# EAGLE board Wio LTE Cat NB1 v1.02 (EAGLE 6.4), part 1 of 2
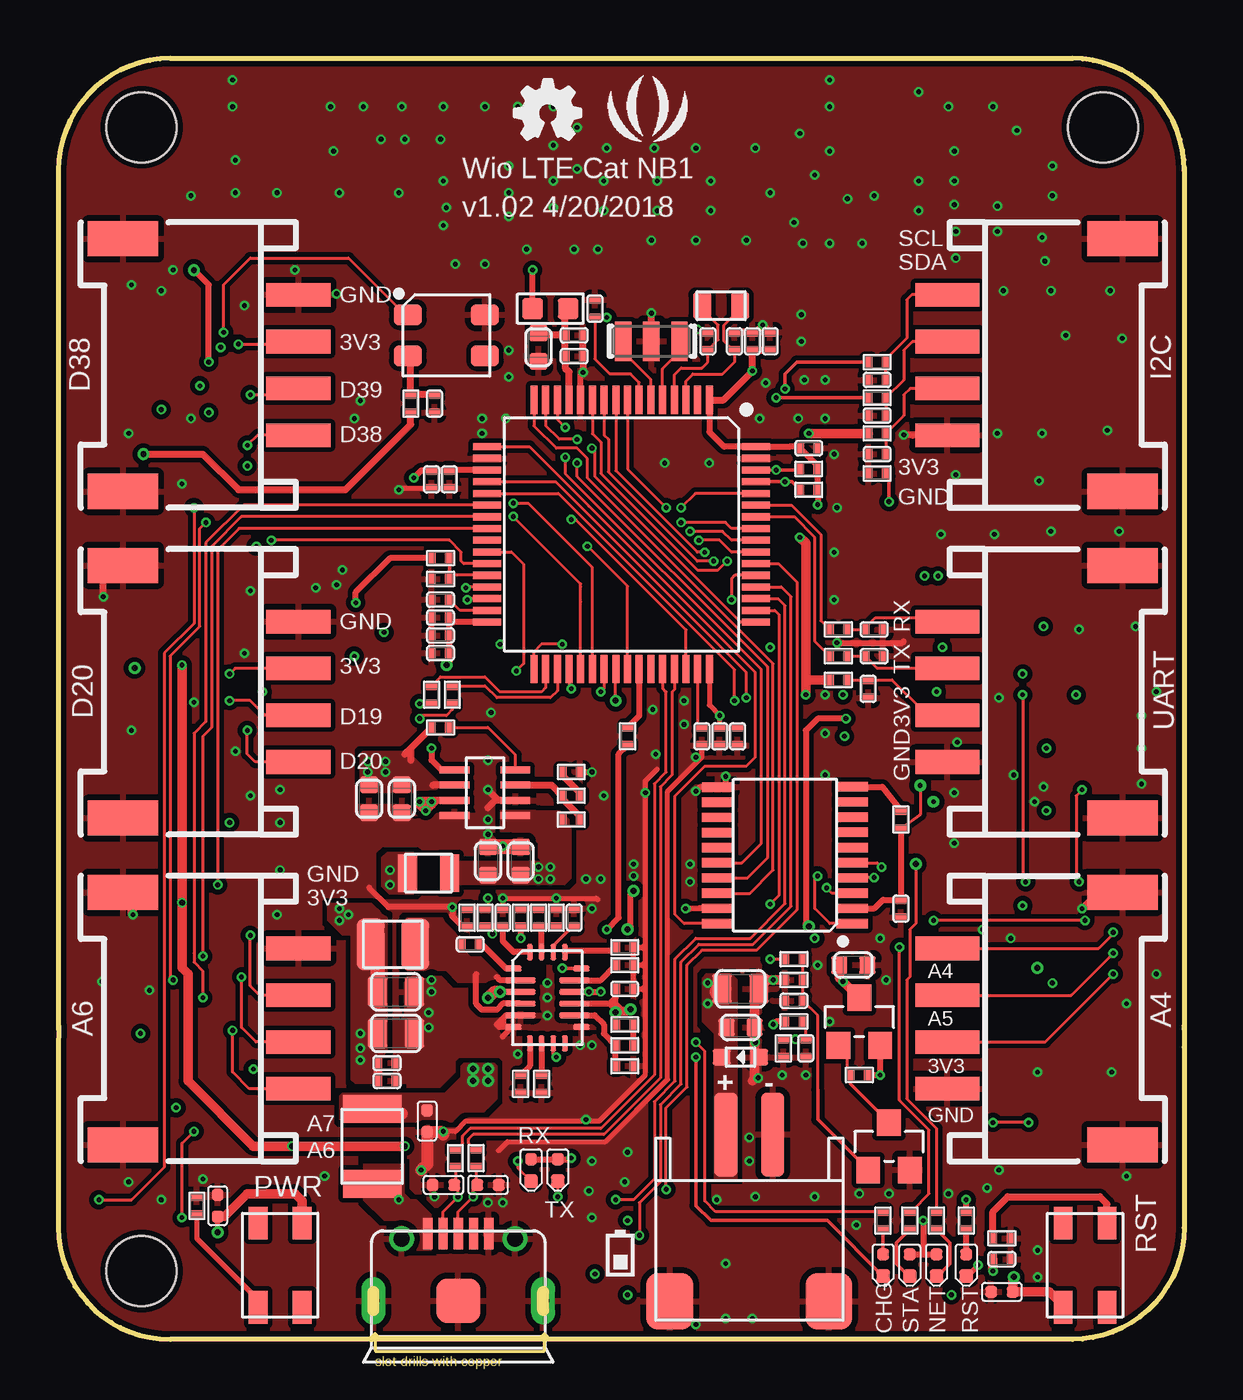
[diagram p7: board, top side]
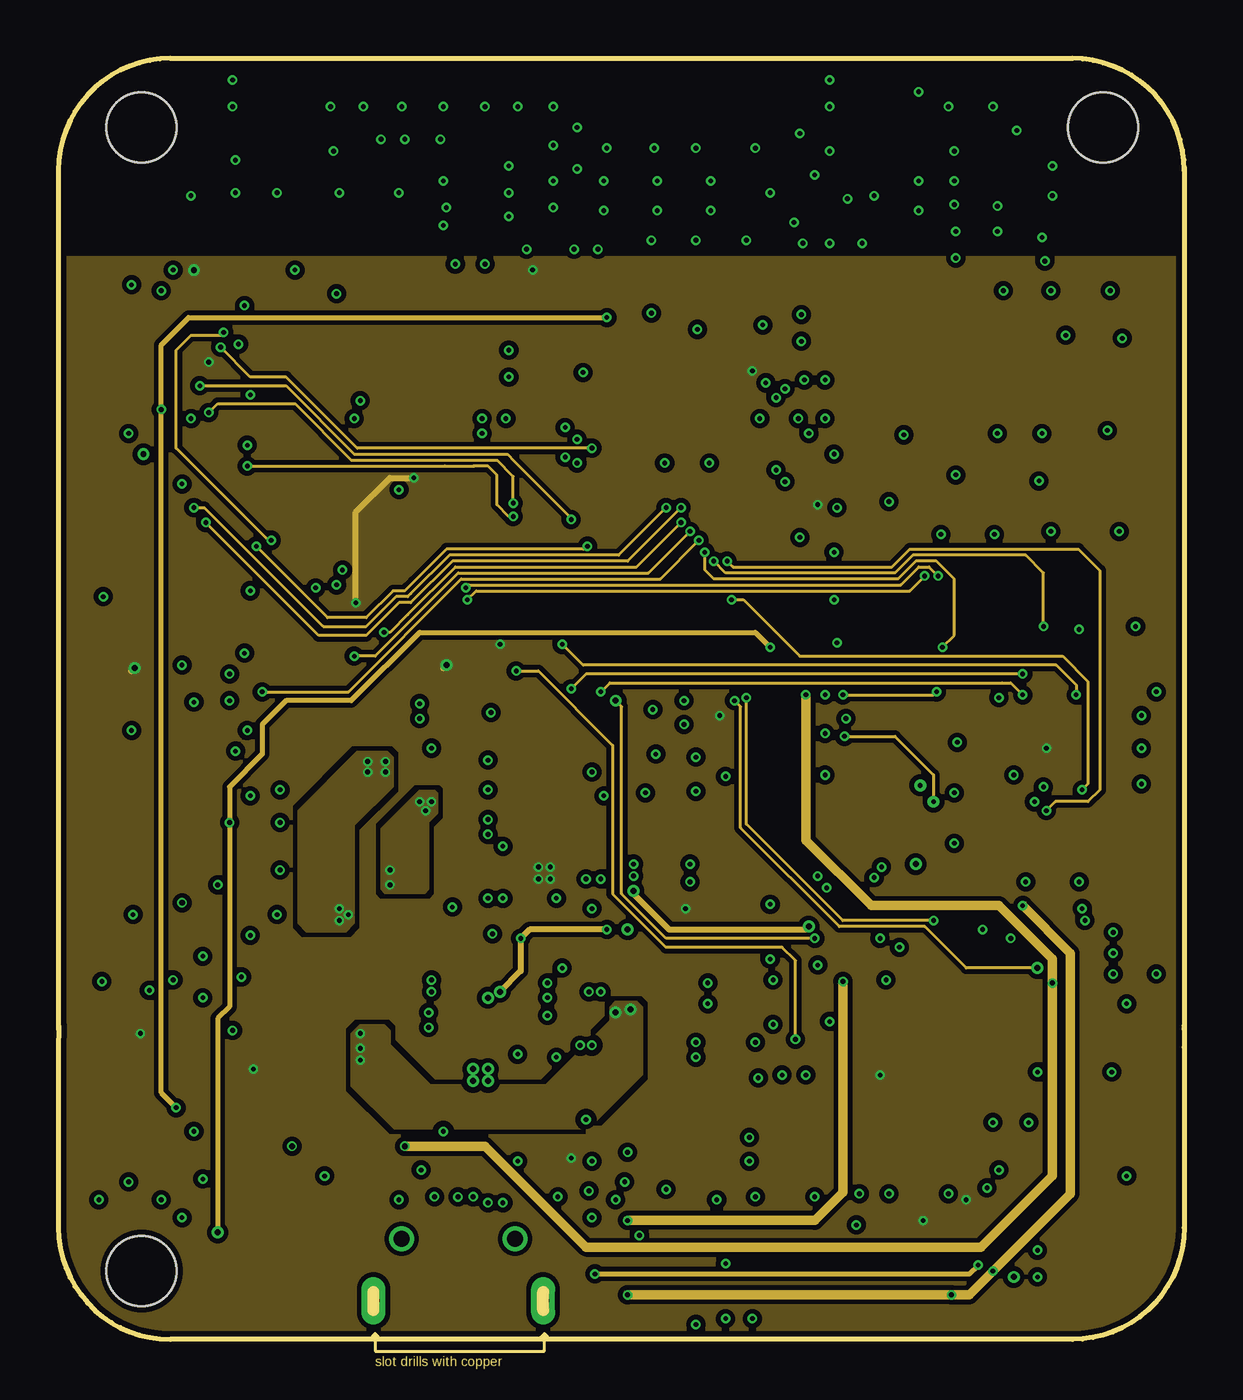
[diagram p8: board, inner layer VDD_3V3]
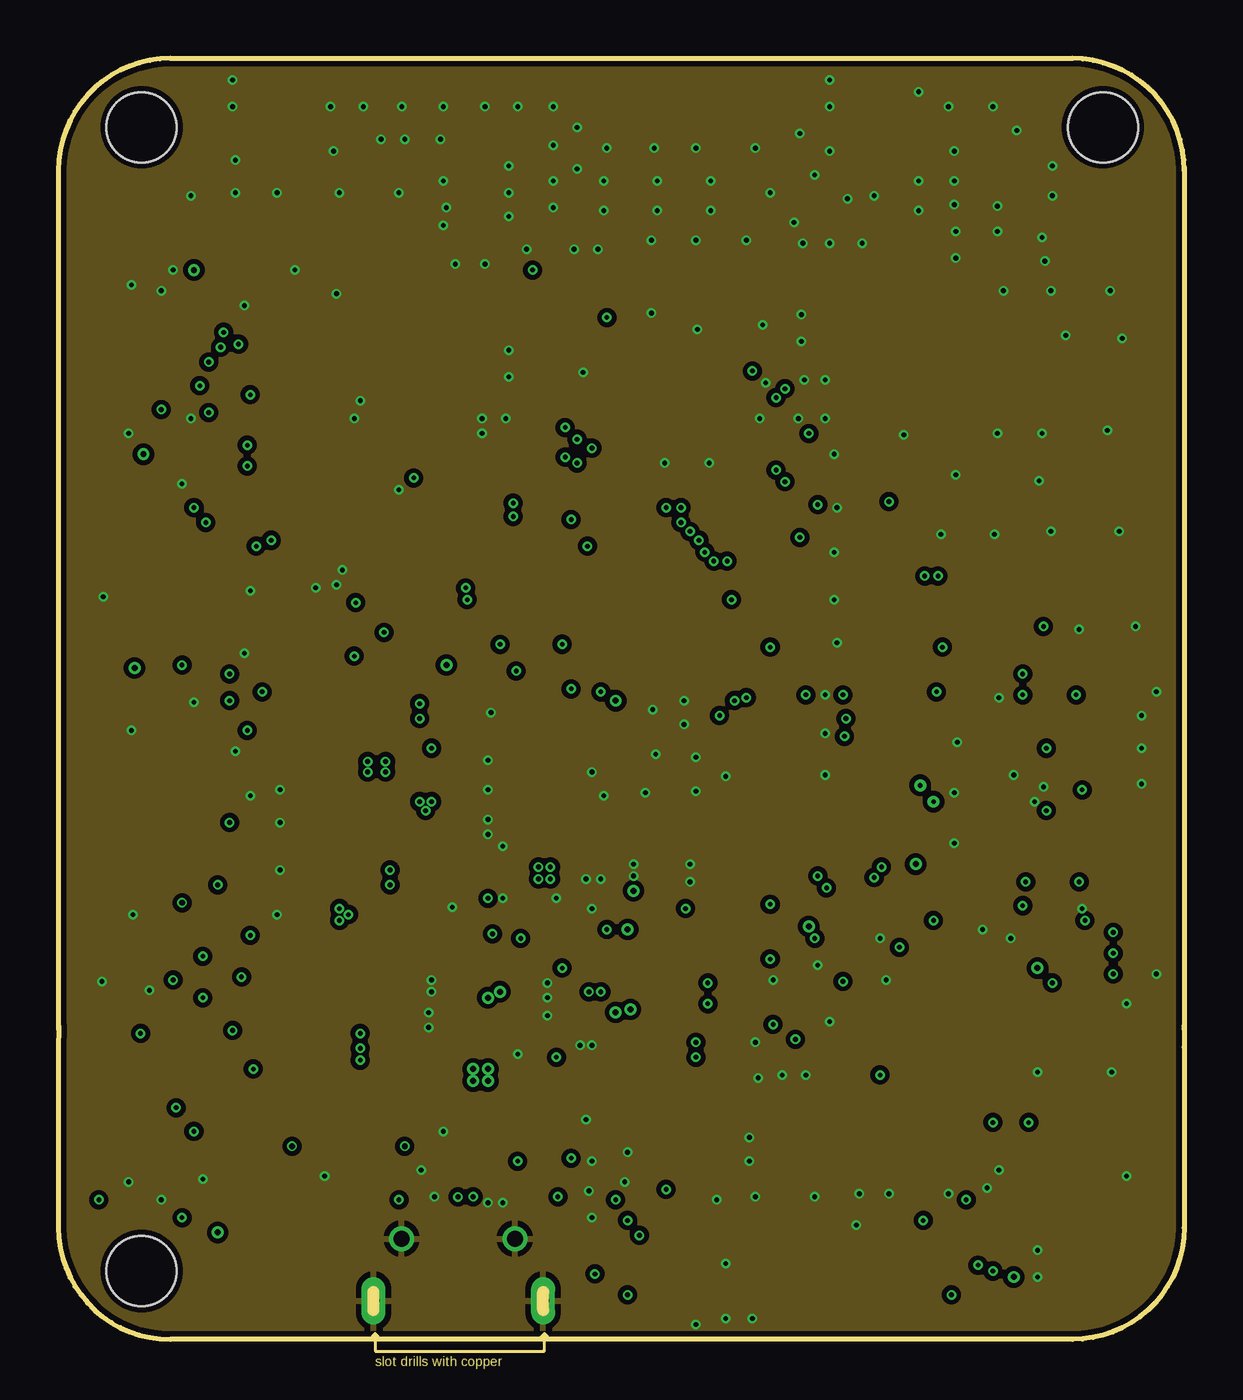
[diagram p9: board, inner layer GND]
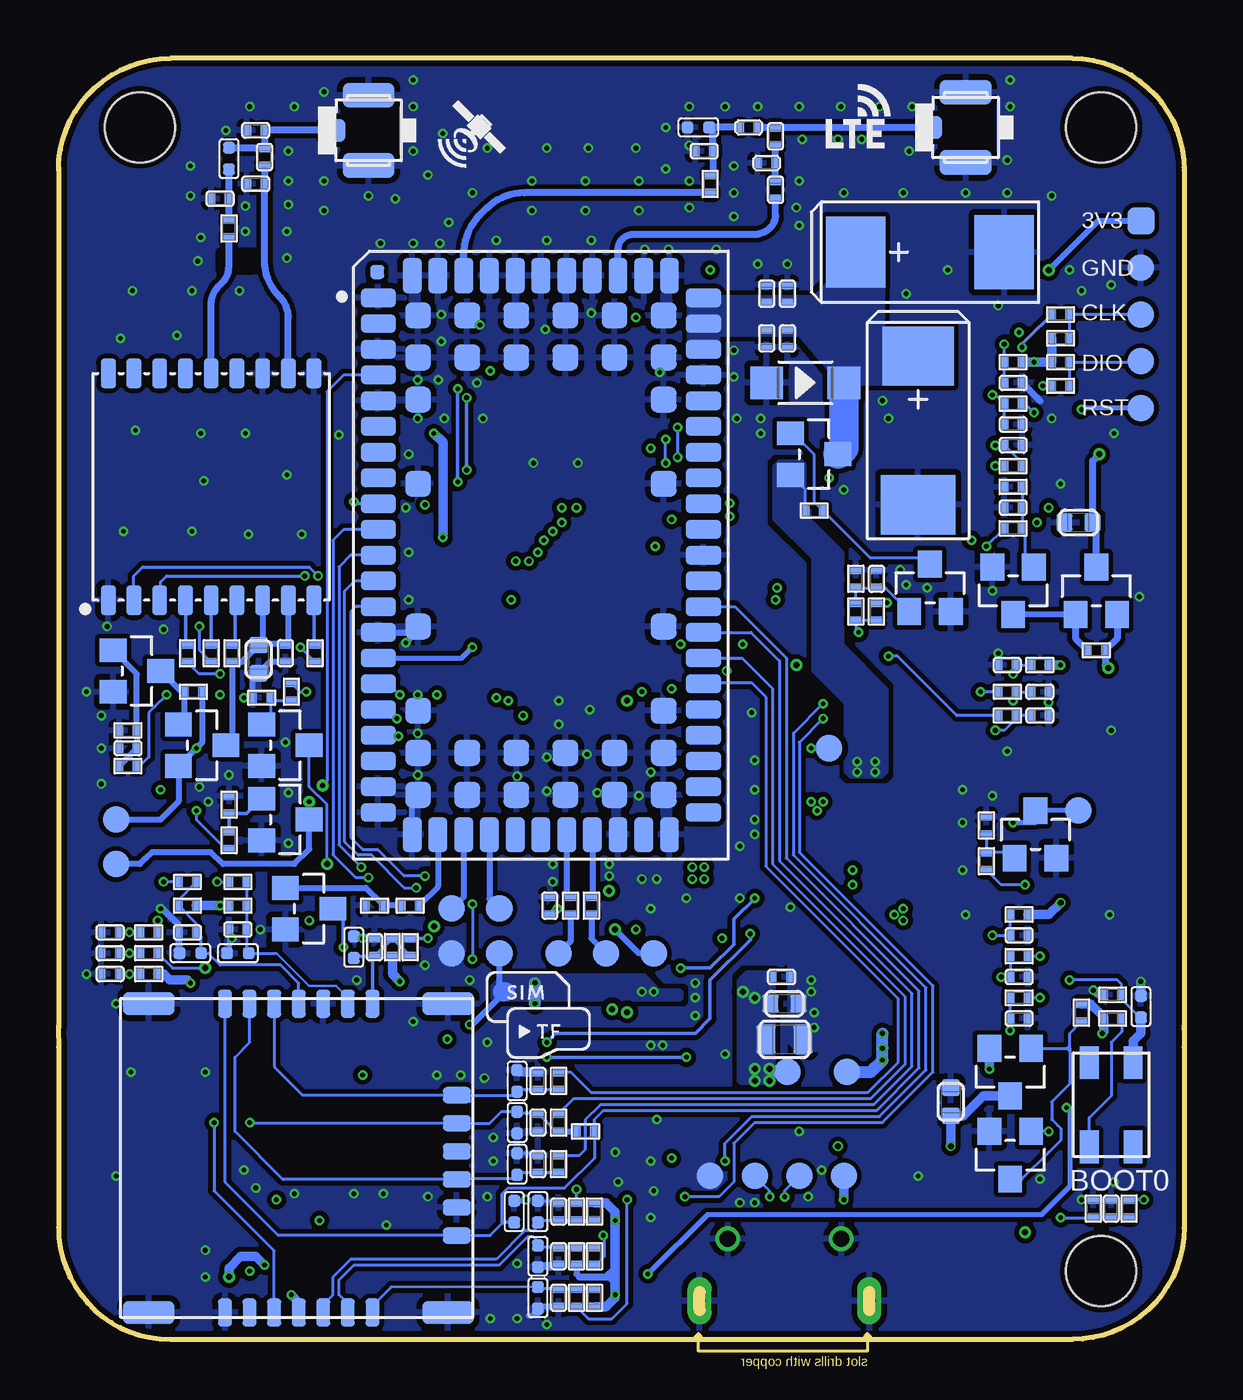
[diagram p10: board, bottom side, seen from below]

Size 48.13 x 54.76 mm. Coordinates in mm from the lower left corner, seen from the top.
Outline: 48.13,49.98 arc90 43.35,54.76 4.78,54.76 arc90 0,49.98
Outline: 0,50.11 0,13.31
Outline: 0,13.42 0,13.27 0,12.49 0,4.78 arc90 4.78,0 43.35,0 arc90 48.13,4.78 48.13,12.49 48.13,13.27 48.13,13.42
Outline: 48.13,50.11 48.13,13.31
Copper layers (1*2*15*16): Top 0.035mm / dielectric 0.2mm / VDD_3V3 0.0175mm / dielectric 0.3mm / GND 0.0175mm / dielectric 0.2mm / Bottom 0.035mm
Design rules "SeeedStudio_4layer_DRU_no_angle_20140221 *": minimum track width 1mil, minimum drill 8mil, track to track 4mil, track to pad 4mil, pad to pad 4mil, via to via 4mil, smd to smd 0mil, copper to edge 10mil, drill to drill 8mil, minimum pad ring 3mil, minimum via ring 3mil, stop-mask expansion 4mil, vias tented up to drill 25mil, thermal gap 10mil
Holes 3 mm at 3.55,2.92 44.65,51.82 3.55,51.82
tRestrict: area 31.1,31.4 to 31.8,32.8; area 19.1,15.4 to 20.7,16.1; area 15.6,19.2 to 16.1,20.7
bRestrict: area 39.8,45.7 to 41.2,46.5; area 23.7,16.5 to 24,16.9

## Footprints (pad centres in the part's own frame; a part is rotated, then mirrored left to right if it is on the bottom)
U-FL3P-SMD-2.6X2.6X1.0MM = smd 1.05 x 1: D -1.524,0 | smd 2.2 x 1.05: GND1 0,1.5; GND2 0,-1.5
C0402 = smd 0.508 x 0.385: 1 0,0.383; 2 0,-0.383
C0603 = smd 0.762 x 0.696: 1 0,0.602; 2 0,-0.602
C0805 = smd 0.819 x 1.27: 1 -0.79,0; 2 0.79,0
AVX-D = smd 2.54 x 3.048: + 3.175,0 | smd 2.54 x 3.175: - -3.175,0
SOD-123 = smd 1.397 x 1.397: + 1.651,0; - -1.651,0
LED-0402 = smd 0.5 x 0.5: + 0.463,0 | smd 0.58 x 0.58: - -0.468,0
ESD-0402 = smd 0.5 x 0.5: 1 -0.463,0; 2 0.463,0
SOD-523 = smd 0.762 x 0.7: + 0.8,0; - -0.8,0
F1210 = smd 1.2 x 2.5: 1 -1.6,0; 2 1.6,0
HW4-SMD-2.0-90D = smd 1.01 x 2.74: 1 -3,-0.1; 2 -1,-0.1; 3 1,-0.1; 4 3,-0.1 | smd 1.5 x 3: SS1 -5.4,7.4; SS2 5.4,7.4
SIM+TF-24P-SMD-1.2-15.05X13.66X2.5MM = smd 1.2 x 0.6: P1 0,3.26; P2 0,4.31; P3 0,5.36; P5 13.2,3.26; P6 13.2,4.31; P7 13.2,5.36; T1 13.2,9.56; T2 13.2,8.51; T3 13.2,7.46; T4 13.2,6.41; T5 0,6.41; T6 0,7.46; T7 0,8.51; T8 0,9.56 | smd 0.7 x 1.2: P1B 9.91,13.17; P2B 7.51,13.17; P3B 3.91,13.17; P5B 8.71,13.17; P6B 6.31,13.17; P7B 5.11,13.17 | smd 1 x 2.2: PAD 0,0; PAD1 0,12.8; PAD2 13.2,0; PAD3 13.2,12.8
H5-SMD-2.0-TEST = smd 1.143 x 1.143: 1 0,4; 2 0,2; 3 0,0; 4 0,-2; 5 0,-4
MICRO-USB5+5P-SMD-0.65-7.2X5.06MM = smd 0.4 x 1.35: 1 -1.3,2.875; 2 -0.65,2.875; 3 0,2.875; 4 0.65,2.875; 5 1.3,2.875 | smd 1.9 x 1.9: P1 0,0 | drill 0.508 pad 1.016 long: P3 -3.625,0; P4 3.625,0 | drill 0.7: P5 -2.425,2.65; P6 2.425,2.65
HW2-SMD-2.0-90D = smd 2 x 2.4: 3 3.4,-2.181; 4 -3.4,-2.181 | smd 1 x 3.6: + -1,4.953; - 1,4.953
SW4P-SMD-4.5X3.2X2.5MM = smd 1.4 x 0.8: 1 -1.8,-0.94; 2 1.8,-0.94; 3 1.8,0.94; 4 -1.8,0.94
L0402 = smd 0.5 x 0.5: 1 -0.463,0; 2 0.463,0
L0402' = smd 0.508 x 0.385: 1 0,0.383; 2 0,-0.383
L0603 = smd 0.889 x 0.889: 1 -0.762,0; 2 0.762,0
L201610 = smd 0.8 x 1.6: 1 -0.9,0; 2 0.9,0
L2520 = smd 2.2 x 1.2: 1 0,0.95; 2 0,-0.95
LED4-1.75-3.7X3.5X0.95MM = smd 1.2 x 0.9: 1 -1.65,0.875; 2 -1.65,-0.875; 3 1.65,-0.875; 4 1.65,0.875
SOT-23 = smd 1.143 x 1.016: 1 1.016,-0.889; 2 1.016,0.889; 3 -1.016,0
R0402 = smd 0.508 x 0.385: 1 0,0.383; 2 0,-0.383
TP-D45MIL = smd 1.143 x 1.143: T 0,0
LGA18-1.1-9.7X10.1X2.5MM = smd 1.27 x 0.635: 1 4.85,-4.4; 2 4.85,-3.3; 3 4.85,-2.2; 4 4.85,-1.1; 5 4.85,0; 6 4.85,1.1; 7 4.85,2.2; 8 4.85,3.3; 9 4.85,4.4; 10 -4.85,4.4; 11 -4.85,3.3; 12 -4.85,2.2; 13 -4.85,1.1; 14 -4.85,0; 15 -4.85,-1.1; 16 -4.85,-2.2; 17 -4.85,-3.3; 18 -4.85,-4.4
LQFP64 = smd 0.3 x 1.2: 1 -3.75,-5.75; 2 -3.25,-5.75; 3 -2.75,-5.75; 4 -2.25,-5.75; 5 -1.75,-5.75; 6 -1.25,-5.75; 7 -0.75,-5.75; 8 -0.25,-5.75; 9 0.25,-5.75; 10 0.75,-5.75; 11 1.25,-5.75; 12 1.75,-5.75; 13 2.25,-5.75; 14 2.75,-5.75; 15 3.25,-5.75; 16 3.75,-5.75; 33 3.75,5.75; 34 3.25,5.75; 35 2.75,5.75; 36 2.25,5.75; 37 1.75,5.75; 38 1.25,5.75; 39 0.75,5.75; 40 0.25,5.75; 41 -0.25,5.75; 42 -0.75,5.75; 43 -1.25,5.75; 44 -1.75,5.75; 45 -2.25,5.75; 46 -2.75,5.75; 47 -3.25,5.75; 48 -3.75,5.75 | smd 1.2 x 0.3: 17 5.75,-3.75; 18 5.75,-3.25; 19 5.75,-2.75; 20 5.75,-2.25; 21 5.75,-1.75; 22 5.75,-1.25; 23 5.75,-0.75; 24 5.75,-0.25; 25 5.75,0.25; 26 5.75,0.75; 27 5.75,1.25; 28 5.75,1.75; 29 5.75,2.25; 30 5.75,2.75; 31 5.75,3.25; 32 5.75,3.75; 49 -5.75,3.75; 50 -5.75,3.25; 51 -5.75,2.75; 52 -5.75,2.25; 53 -5.75,1.75; 54 -5.75,1.25; 55 -5.75,0.75; 56 -5.75,0.25; 57 -5.75,-0.25; 58 -5.75,-0.75; 59 -5.75,-1.25; 60 -5.75,-1.75; 61 -5.75,-2.25; 62 -5.75,-2.75; 63 -5.75,-3.25; 64 -5.75,-3.75
MOUDLE96P-SMD-1.1-26X16X2.53MM = smd 1.5 x 0.8: 1 -6.95,11; 2 -6.95,9.9; 3 -6.95,8.8; 4 -6.95,7.7; 5 -6.95,6.6; 6 -6.95,5.5; 7 -6.95,4.4; 8 -6.95,3.3; 9 -6.95,2.2; 10 -6.95,1.1; 11 -6.95,0; 12 -6.95,-1.1; 13 -6.95,-2.2; 14 -6.95,-3.3; 15 -6.95,-4.4; 16 -6.95,-5.5; 17 -6.95,-6.6; 18 -6.95,-7.7; 19 -6.95,-8.8; 20 -6.95,-9.9; 21 -6.95,-11; 33 6.95,-11; 34 6.95,-9.9; 35 6.95,-8.8; 36 6.95,-7.7; 37 6.95,-6.6; 38 6.95,-5.5; 39 6.95,-4.4; 40 6.95,-3.3; 41 6.95,-2.2; 42 6.95,-1.1; 43 6.95,0; 44 6.95,1.1; 45 6.95,2.2; 46 6.95,3.3; 47 6.95,4.4; 48 6.95,5.5; 49 6.95,6.6; 50 6.95,7.7; 51 6.95,8.8; 52 6.95,9.9; 53 6.95,11 | smd 0.8 x 1.5: 22 -5.5,-11.95; 23 -4.4,-11.95; 24 -3.3,-11.95; 25 -2.2,-11.95; 26 -1.1,-11.95; 27 0,-11.95; 28 1.1,-11.95; 29 2.2,-11.95; 30 3.3,-11.95; 31 4.4,-11.95; 32 5.5,-11.95; 54 5.5,11.95; 55 4.4,11.95; 56 3.3,11.95; 57 2.2,11.95; 58 1.1,11.95; 59 0,11.95; 60 -1.1,11.95; 61 -2.2,11.95; 62 -3.3,11.95; 63 -4.4,11.95; 64 -5.5,11.95 | smd 1.1 x 1.1: 65 -5.25,10.25; 66 -3.15,10.25; 67 -1.05,10.25; 68 1.05,10.25; 69 3.15,10.25; 70 5.25,10.25; 71 -5.25,8.45; 72 -3.15,8.45; 73 -1.05,8.45; 74 1.05,8.45; 75 3.15,8.45; 76 5.25,8.45; 77 -5.25,6.65; 78 5.25,6.65; 79 -5.25,3.05; 80 5.25,3.05; 81 -5.25,-3.05; 82 5.25,-3.05; 83 -5.25,-6.65; 84 5.25,-6.65; 85 -5.25,-8.45; 86 -3.15,-8.45; 87 -1.05,-8.45; 88 1.05,-8.45; 89 3.15,-8.45; 90 5.25,-8.45; 91 -5.25,-10.25; 92 -3.15,-10.25; 93 -1.05,-10.25; 94 1.05,-10.25; 95 3.15,-10.25; 96 5.25,-10.25 | smd 0.6 x 0.6: P$1 -7,12.1
TSOT23-8 = smd 0.3 x 1.27: 1 -0.975,-1.3; 2 -0.325,-1.3; 3 0.325,-1.3; 4 0.975,-1.3; 5 0.975,1.3; 6 0.325,1.3; 7 -0.325,1.3; 8 -0.975,1.3
QFN20-0.5-3X4X1MM = smd 0.7 x 0.25: 1 -1.45,1.25; 6 -1.45,-1.25; 11 1.45,-1.25; 16 1.45,1.25 | smd 1.3 x 0.25: 2 -1.15,0.75; 3 -1.15,0.25; 4 -1.15,-0.25; 5 -1.15,-0.75; 12 1.15,-0.75; 13 1.15,-0.25; 14 1.15,0.25; 15 1.15,0.75 | smd 0.25 x 0.7: 7 -0.75,-1.95; 8 -0.25,-1.95; 9 0.25,-1.95; 10 0.75,-1.95; 17 0.75,1.95; 18 0.25,1.95; 19 -0.25,1.95; 20 -0.75,1.95
TSSOP20-0.65-6.5X4.4MM = smd 0.4 x 1.35: 1 -2.925,-2.875; 2 -2.275,-2.875; 3 -1.625,-2.875; 4 -0.975,-2.875; 5 -0.325,-2.875; 6 0.325,-2.875; 7 0.975,-2.875; 8 1.625,-2.875; 9 2.275,-2.875; 10 2.925,-2.875; 11 2.91,2.875; 12 2.26,2.875; 13 1.61,2.875; 14 0.96,2.875; 15 0.325,2.875; 16 -0.325,2.875; 17 -0.975,2.875; 18 -1.625,2.875; 19 -2.275,2.875; 20 -2.925,2.875
X2-SMD-L2.0X1.2X0.55MM = smd 0.762 x 1.143: 1 -0.813,0; 2 0.813,0
RESONATOR3-SMD-3.6X1.3X0.8MM = smd 0.7 x 1.7: 1 -1.2,0; 2 0,0; 3 1.2,0

## Placement (x,y rotation side)
ANT1  U-FL  [U-FL3P-SMD-2.6X2.6X1.0MM]  34.87,51.69 0 bottom
ANT2  U-FL  [U-FL3P-SMD-2.6X2.6X1.0MM]  9.35,51.82 0 bottom
C1  100nF  [C0402]  38.43,29.34 0 bottom
C2  10uF  [C0603]  39.57,29.08 0 bottom
C3  100nF  [C0402]  45.16,25.27 270 bottom
C4  22uF  [C0805]  14.43,13.08 180 top
C5  0R  [C0402]  39.32,50.55 0 bottom
C6  DNP  [C0402]  39.7,49.4 90 bottom
C7  DNP  [C0402]  39.7,51.69 90 bottom
C8  22pF  [C0402]  28.91,42.67 180 top
C9  22pF  [C0402]  27.76,42.67 180 top
C10  10uF  [C0603]  33.99,16 90 top
C11  33pF  [C0402]  7.06,17.27 90 bottom
C12  33pF  [C0402]  7.06,15.49 90 bottom
C13  33pF  [C0402]  7.06,13.72 90 bottom
C14  33pF  [C0402]  7.32,38.23 90 bottom
C15  33pF  [C0402]  7.32,39.12 90 bottom
C16  33pF  [C0402]  7.32,40.89 90 bottom
C17  33pF  [C0402]  7.57,28.83 270 bottom
C18  33pF  [C0402]  6.17,27.69 90 bottom
C19  33pF  [C0402]  6.17,26.67 90 bottom
C20  0R  [C0402]  17.48,49.15 0 bottom
C21  0R  [C0402]  17.48,51.44 0 bottom
C22  100nF  [C0402]  31.45,14.48 270 top
C23  DNP  [AVX-D]  10.87,46.48 180 bottom
C24  DNP  [AVX-D]  11.38,38.86 90 bottom
C25  100nF  [C0402]  16.97,42.8 180 bottom
C26  10nF  [C0402]  16.97,44.7 0 bottom
C27  68pF  [C0402]  17.86,42.8 180 bottom
C28  15pF  [C0402]  17.86,44.7 0 bottom
C29  100nF  [C0402]  13.16,32.51 180 bottom
C30  DNP  [C0402]  20.52,50.8 270 bottom
C31  100nF  [C0402]  22.94,44.07 180 top
C32  1uF  [C0603]  20.52,42.42 0 top
C33  33pF  [C0402]  34.62,27.81 0 top
C34  33pF  [C0402]  34.87,29.21 90 top
C35  33pF  [C0402]  34.87,30.35 90 top
C36  33pF  [C0402]  45.92,15.62 270 bottom
C37  33pF  [C0402]  45.92,16.51 270 bottom
C38  33pF  [C0402]  45.92,17.4 270 bottom
C39  4.7uF  [C0402]  16.33,31.62 90 top
C40  4.7uF  [C0402]  27.51,25.78 180 top
C41  33pF  [C0402]  27.64,9.27 0 bottom
C42  33pF  [C0402]  27.64,11.05 180 bottom
C43  33pF  [C0402]  27.64,7.49 180 bottom
C44  33pF  [C0402]  34.62,16.76 180 bottom
C45  33pF  [C0402]  26.75,1.78 0 bottom
C46  33pF  [C0402]  26.75,3.56 0 bottom
C47  33pF  [C0402]  26.75,5.46 180 bottom
C48  33pF  [C0402]  42.62,17.4 270 bottom
C49  33pF  [C0402]  40.46,17.53 270 bottom
C50  100nF  [C0402]  40.34,3.43 270 top
C51  10uF  [C0603]  9.98,10.16 180 bottom
C52  100nF  [C0402]  3.12,5.59 180 bottom
C53  33pF  [C0402]  35,37.85 270 top
C54  33pF  [C0402]  35,39.5 270 top
C55  33pF  [C0402]  35,41.02 270 top
C56  100nF  [C0402]  16.71,36.77 180 top
C57  1uF  [C0402]  15.95,36.77 180 top
C58  100nF  [C0402]  16.33,30.86 90 top
C59  1uF  [C0402]  16.33,30.1 90 top
C60  100nF  [C0402]  28.27,25.78 180 top
C61  1uF  [C0402]  29.03,25.78 180 top
C62  100nF  [C0402]  32.08,38.1 270 top
C63  1uF  [C0402]  16.33,29.34 90 top
C64  100nF  [C0402]  29.67,42.67 0 top
C65  1uF  [C0402]  30.43,42.67 0 top
C66  100nF  [C0402]  22.05,42.93 270 top
C67  1uF  [C0402]  22.05,42.04 270 top
C68  10uF  [C0603]  4.52,34.92 270 bottom
C69  10uF  [C0603]  13.28,23.11 180 top
C70  10uF  [C0603]  14.68,23.11 180 top
C71  10uF  [C0603]  18.36,20.45 0 top
C72  10uF  [C0603]  19.76,20.45 0 top
C73  10nF  [C0402]  41.22,48.77 90 bottom
C74  1uF  [C0402]  14.05,11.05 270 top
C75  100nF  [C0402]  7.32,35.56 270 bottom
C76  1uF  [C0402]  16.08,40.01 180 top
C77  100nF  [C0402]  17.6,16.89 270 top
C78  100nF  [C0402]  24.21,14.99 270 top
C79  1uF  [C0402]  14.05,11.81 270 top
C80  22uF  [C0805]  14.43,14.86 180 top
C81  10uF  [C0805]  17.09,12.83 0 bottom
C82  4.7uF  [C0603]  17.09,14.35 90 bottom
C83  100nF  [C0402]  17.22,15.49 90 bottom
C84  100nF  [C0402]  36.02,18.41 180 top
C85  100nF  [C0402]  27.13,18.54 0 bottom
C86  1uF  [C0402]  19,18.03 0 top
C87  100nF  [C0402]  22.05,18.03 0 top
C88  22uF  [C0805]  29.16,14.99 0 top
C89  10uF  [C0603]  29.16,13.34 90 top
C90  100nF  [C0402]  31.95,12.45 0 top
D1  DNP  [SOD-123]  16.21,40.89 180 bottom
D2  RED  [LED-0402]  38.81,3.17 90 top
D3  DNP  [ESD-0402]  20.78,51.82 0 bottom
D4  YELLOW  [LED-0402]  36.4,3.17 90 top
D5  DNP  [ESD-0402]  28.52,9.27 90 bottom
D6  DNP  [ESD-0402]  28.52,11.05 270 bottom
D7  DNP  [ESD-0402]  28.52,7.49 270 bottom
D8  DNP  [ESD-0402]  28.65,5.46 270 bottom
D9  DNP  [ESD-0402]  35.51,16.76 270 bottom
D10  DNP  [ESD-0402]  27.64,1.78 90 bottom
D11  DNP  [ESD-0402]  27.64,3.56 90 bottom
D12  DNP  [ESD-0402]  27.64,5.46 270 bottom
D13  DNP  [ESD-0402]  42.49,16.51 0 bottom
D14  DNP  [ESD-0402]  40.46,16.51 0 bottom
D15  Blue  [LED-0402]  37.54,3.17 90 top
D16  DNP  [ESD-0402]  15.76,9.33 90 top
D17  ESDPSA0402V05  [ESD-0402]  16.46,6.6 0 top
D18  ESDPSA0402V05  [ESD-0402]  18.36,6.6 180 top
D19  DNP  [ESD-0402]  40.34,2.03 0 top
D20  RED  [LED-0402]  21.35,7.24 90 top
D21  GREEN  [LED-0402]  20.21,7.24 90 top
D22  DNP  [ESD-0402]  6.81,5.71 270 top
D23  RED  [LED-0402]  35.26,3.17 90 top
D24  DNP  [ESD-0402]  1.85,14.22 270 bottom
D25  DNP  [SOD-523]  29.16,12.06 0 top
F1  SMD1210R200SF  [F1210]  13.41,8.26 90 top
FR1  SEEEDSTUDIO-OPEN-SCH-FRAME  [SEEEDSTUDIO-PCB-FRAME]  115.39,60.71 0 top  (outside the outline)
FR2  SEEEDSTUDIO-OPEN-SCH-FRAME  [SEEEDSTUDIO-PCB-FRAME]  -12.62,-33.66 0 top  (outside the outline)
FR3  SEEEDSTUDIO-OPEN-SCH-FRAME  [SEEEDSTUDIO-PCB-FRAME]  115.39,-0.25 0 top  (outside the outline)
FR4  SEEEDSTUDIO-OPEN-SCH-FRAME  [SEEEDSTUDIO-PCB-FRAME]  115.39,7.37 0 top  (outside the outline)
FR5  SEEEDSTUDIO-OPEN-SCH-FRAME  [SEEEDSTUDIO-PCB-FRAME]  115.39,37.85 0 top  (outside the outline)
FR6  SEEEDSTUDIO-OPEN-SCH-FRAME  [SEEEDSTUDIO-PCB-FRAME]  115.39,45.47 0 top  (outside the outline)
FR7  SEEEDSTUDIO-OPEN-SCH-FRAME  [SEEEDSTUDIO-PCB-FRAME]  115.39,14.99 0 top  (outside the outline)
FR8  SEEEDSTUDIO-OPEN-SCH-FRAME  [SEEEDSTUDIO-PCB-FRAME]  115.39,22.61 0 top  (outside the outline)
J1  GROVE  [HW4-SMD-2.0-90D]  10.16,41.66 90 top
J2  GROVE  [HW4-SMD-2.0-90D]  10.16,27.69 90 top
J3  GROVE  [HW4-SMD-2.0-90D]  10.16,13.72 90 top
J4  GROVE  [HW4-SMD-2.0-90D]  38.1,27.69 270 top
J5  GROVE  [HW4-SMD-2.0-90D]  38.1,13.72 270 top
J6  HC55-SIM20-250  [SIM+TF-24P-SMD-1.2-15.05X13.66X2.5MM]  44.27,14.35 270 bottom
J7  GROVE  [HW4-SMD-2.0-90D]  38.1,41.66 270 top
J8  DNP  [H5-SMD-2.0-TEST]  1.85,43.81 0 bottom
J9  USB-MC-001-05  [MICRO-USB5+5P-SMD-0.65-7.2X5.06MM]  17.09,1.65 0 top
J10  JST-2P-SMD-90D  [HW2-SMD-2.0-90D]  29.54,3.81 0 top
K1  SKRPADE010  [SW4P-SMD-4.5X3.2X2.5MM]  3.12,10.03 270 bottom
K2  SKRPABE010  [SW4P-SMD-4.5X3.2X2.5MM]  43.89,3.17 270 top
K3  SKRPABE010  [SW4P-SMD-4.5X3.2X2.5MM]  9.47,3.17 90 top
L1  27nH  [L0402]  40.84,50.48 90 bottom
L3  DNP  [L0402']  17.86,50.29 90 bottom
L4  DNP  [L0402']  18.62,51.82 270 bottom
L5  30R/3000mA  [L0603]  21.03,44.07 0 top
L6  1uH  [L201610]  15.82,19.94 0 top
L7  SPH25201H1R2MT  [L2520]  14.3,16.89 270 top
LED1  SK6812MINI  [LED4-1.75-3.7X3.5X0.95MM]  16.59,42.93 180 top
Q1  NCE3407A  [SOT-23]  41.99,25.4 180 bottom
Q2  BSS138LT3G  [SOT-23]  44.78,28.57 180 bottom
Q3  NCE3407A  [SOT-23]  34.24,13.59 270 top
Q4  NCE3407A  [SOT-23]  15.82,37.85 180 bottom
Q5  BSS138LT3G  [SOT-23]  35.51,8.26 270 top
Q6  BSS138LT3G  [SOT-23]  10.87,32.13 270 bottom
Q7  BSS138LT3G  [SOT-23]  6.36,21.59 270 bottom
Q8  BSS138LT3G  [SOT-23]  38.43,22.23 180 bottom
Q9  BSS138LT3G  [SOT-23]  37.41,18.41 180 bottom
Q10  NCE3407A  [SOT-23]  7.44,11.43 90 bottom
Q11  BSS138LT3G  [SOT-23]  7.44,7.87 90 bottom
Q12  BSS138LT3G  [SOT-23]  38.43,25.4 180 bottom
Q13  NCE3407A  [SOT-23]  3.76,32 270 bottom
Q14  BSS138LT3G  [SOT-23]  7.32,32 90 bottom
R1  470k  [R0402]  42.37,27.69 90 bottom
R2  DNP  [R0402]  37.16,29.34 0 bottom
R3  0R  [R0402]  40.72,29.34 0 bottom
R4  0R  [R0402]  41.61,29.34 0 bottom
R5  1k  [R0402]  45.16,24.51 90 bottom
R6  DNP  [R0402]  42.62,29.34 0 bottom
R7  1M  [R0402]  45.16,26.04 90 bottom
R8  0R  [R0402]  40.84,47.5 180 bottom
R10  0R  [R0402]  7.32,37.34 270 bottom
R11  0R  [R0402]  7.57,26.67 270 bottom
R12  0R  [R0402]  7.06,14.61 90 bottom
R13  0R  [R0402]  7.32,40.01 90 bottom
R14  470k  [R0402]  34.24,11.3 90 top
R15  0R  [R0402]  7.57,27.69 270 bottom
R16  0R  [R0402]  7.06,16.38 90 bottom
R17  0R  [R0402]  7.32,41.78 90 bottom
R18  0R  [R0402]  6.17,28.83 90 bottom
R19  0R  [R0402]  7.06,18.16 90 bottom
R20  470k  [R0402]  15.82,35.43 270 bottom
R21  1k  [R0402]  31.45,16.26 270 top
R22  0R  [R0402]  24.33,25.78 180 top
R23  DNP  [R0402]  13.16,31.11 180 bottom
R24  1M  [R0402]  31.45,15.37 90 top
R25  1k  [R0402]  14.05,31.11 0 bottom
R26  1k  [R0402]  38.81,5.08 0 top
R27  1M  [R0402]  14.05,32.51 0 bottom
R28  DNP  [R0402]  33.86,16.76 180 bottom
R29  DNP  [R0402]  25.22,1.78 180 bottom
R30  DNP  [R0402]  25.98,3.56 180 bottom
R31  DNP  [R0402]  25.22,5.46 0 bottom
R32  DNP  [R0402]  42.62,18.54 270 bottom
R33  DNP  [R0402]  40.46,18.54 90 bottom
R34  DNP  [R0402]  20.27,49.4 180 bottom
R35  0R  [R0402]  33.35,30.35 270 top
R36  0R  [R0402]  44.27,17.4 90 bottom
R37  15k  [R0402]  25.6,8.89 270 bottom
R38  0R  [R0402]  33.35,29.21 270 top
R39  0R  [R0402]  44.27,16.51 90 bottom
R40  0R  [R0402]  33.35,28.19 270 top
R41  0R  [R0402]  44.27,15.62 90 bottom
R42  4.7k  [R0402]  32.08,37.21 90 top
R43  4.7k  [R0402]  32.08,36.32 90 top
R44  0R  [R0402]  25.98,1.78 0 bottom
R45  0R  [R0402]  25.22,3.56 0 bottom
R46  1k  [R0402]  8.46,20.45 0 bottom
R47  0R  [R0402]  25.98,5.46 180 bottom
R48  22R  [R0402]  26.75,7.49 0 bottom
R49  22R  [R0402]  26.75,11.05 0 bottom
R50  10k  [R0402]  8.46,21.97 180 bottom
R51  1k  [R0402]  40.84,21.34 0 bottom
R52  1k  [R0402]  36.4,5.08 0 top
R53  0R  [R0402]  42.62,19.56 270 bottom
R54  10k  [R0402]  40.84,22.86 180 bottom
R55  0R  [R0402]  35,37.02 90 top
R56  0R  [R0402]  40.46,19.56 270 bottom
R57  22R  [R0402]  26.75,9.27 0 bottom
R58  1k  [R0402]  33.1,18.54 270 bottom
R59  0R  [R0402]  33.1,16.76 180 bottom
R60  100k  [R0402]  34.62,18.54 270 bottom
R61  DNP  [R0402]  16.33,33.4 270 top
R62  10k  [R0402]  16.33,32.51 90 top
R63  470k  [R0402]  4.39,13.97 180 bottom
R64  22R  [R0402]  26.24,18.54 0 bottom
R65  22R  [R0402]  25.35,18.54 0 bottom
R66  4.7k  [R0402]  3.06,13.72 270 bottom
R67  0R  [R0402]  35,41.78 270 top
R68  0R  [R0402]  35,40.26 270 top
R69  1k  [R0402]  37.54,5.08 0 top
R70  0R  [R0402]  35,38.73 270 top
R71  1k  [R0402]  2.36,5.59 180 bottom
R72  1k  [R0402]  38.18,27.69 0 bottom
R73  1M  [R0402]  3.89,5.59 0 bottom
R74  100k  [R0402]  3.06,14.73 270 bottom
R75  100k  [R0402]  39.45,27.43 270 bottom
R76  DNP  [R0402]  5.28,42.8 270 bottom
R77  DNP  [R0402]  5.28,41.78 270 bottom
R78  0R  [R0402]  5.28,43.81 90 bottom
R79  0R  [R0402]  5.28,40.77 90 bottom
R80  22R  [R0402]  16.97,7.75 180 top
R81  22R  [R0402]  17.86,7.75 180 top
R82  100k  [R0402]  16.33,26.16 90 top
R83  150k_1%  [R0402]  21.92,22.23 270 top
R84  470k  [R0402]  3.76,29.46 90 bottom
R85  33k_1%  [R0402]  21.92,23.24 90 top
R86  0R  [R0402]  40.34,4.32 90 top
R87  0R  [R0402]  21.92,24.26 270 top
R88  1k  [R0402]  7.32,34.67 270 bottom
R89  1M  [R0402]  7.32,36.45 90 bottom
R90  0R  [R0402]  15.06,40.01 180 top
R91  1k  [R0402]  16.84,27.56 0 top
R92  1k  [R0402]  15.95,27.56 0 top
R93  0R  [R0402]  5.92,5.71 180 top
R94  DNP  [R0402]  19.76,10.92 0 top
R95  DNP  [R0402]  20.65,10.92 0 top
R96  20k  [R0402]  19.76,18.03 180 top
R97  0R  [R0402]  20.52,18.03 0 top
R98  24k_1%  [R0402]  24.21,13.46 270 top
R99  1k  [R0402]  35.26,5.08 0 top
R100  2.7k_1%  [R0402]  24.21,12.57 90 top
R101  10k  [R0402]  21.29,18.03 180 top
R102  10k_1%  [R0402]  24.21,11.68 270 top
R103  10k  [R0402]  18.24,18.03 180 top
R104  10M  [R0402]  31.45,13.59 270 top
R105  4.7k  [R0402]  36.02,22.23 0 top
R106  10k  [R0402]  17.48,18.03 0 top
R107  DNP  [R0402]  24.21,16.76 270 top
R108  2k  [R0402]  24.21,16 270 top
R109  10M  [R0402]  31,12.45 180 top
TP1  [TP-D45MIL]  4.52,22.61 180 bottom
TP2  [TP-D45MIL]  45.67,20.32 180 bottom
TP3  [TP-D45MIL]  22.68,16.51 180 bottom
TP4  [TP-D45MIL]  26.75,16.51 180 bottom
TP5  [TP-D45MIL]  24.71,16.51 180 bottom
TP7  [TP-D45MIL]  31.32,18.41 180 bottom
TP8  [TP-D45MIL]  29.29,18.41 180 bottom
TP9  [TP-D45MIL]  14.55,6.99 0 bottom
TP10  [TP-D45MIL]  45.67,22.23 0 bottom
TP11  [TP-D45MIL]  16.46,6.99 0 bottom
TP12  [TP-D45MIL]  18.36,6.99 0 bottom
TP13  [TP-D45MIL]  15.19,25.27 90 bottom
TP14  [TP-D45MIL]  20.27,6.99 0 bottom
TP15  [TP-D45MIL]  16.97,11.43 0 bottom
TP16  [TP-D45MIL]  14.43,11.43 0 bottom
TP17  [TP-D45MIL]  29.29,16.51 90 bottom
TP19  [TP-D45MIL]  31.32,16.51 0 bottom
U1  MAX-M8Q  [LGA18-1.1-9.7X10.1X2.5MM]  41.61,36.45 270 bottom
U3  STM32F405RGT6  [LQFP64]  24.08,34.42 180 top
U4  SARA-R410M  [MOUDLE96P-SMD-1.1-26X16X2.53MM]  27.51,33.53 0 bottom
U5  MP2161GJ  [TSOT23-8]  18.24,23.37 270 top
U6  MP2617B  [QFN20-0.5-3X4X1MM]  20.9,14.61 0 top
U7  TXS0108E  [TSSOP20-0.65-6.5X4.4MM]  31.06,20.7 90 top
U$97  [OSHW_FILLX100_NOTEXT]  19.51,51.31 0 top
U$98  [SEEED-SILK--TNAME-160*153MIL]  25.22,52.7 0 top
X1  32.768KHZ  [X2-SMD-L2.0X1.2X0.55MM]  28.33,44.2 180 top
X2  8M  [RESONATOR3-SMD-3.6X1.3X0.8MM]  25.35,42.67 180 top